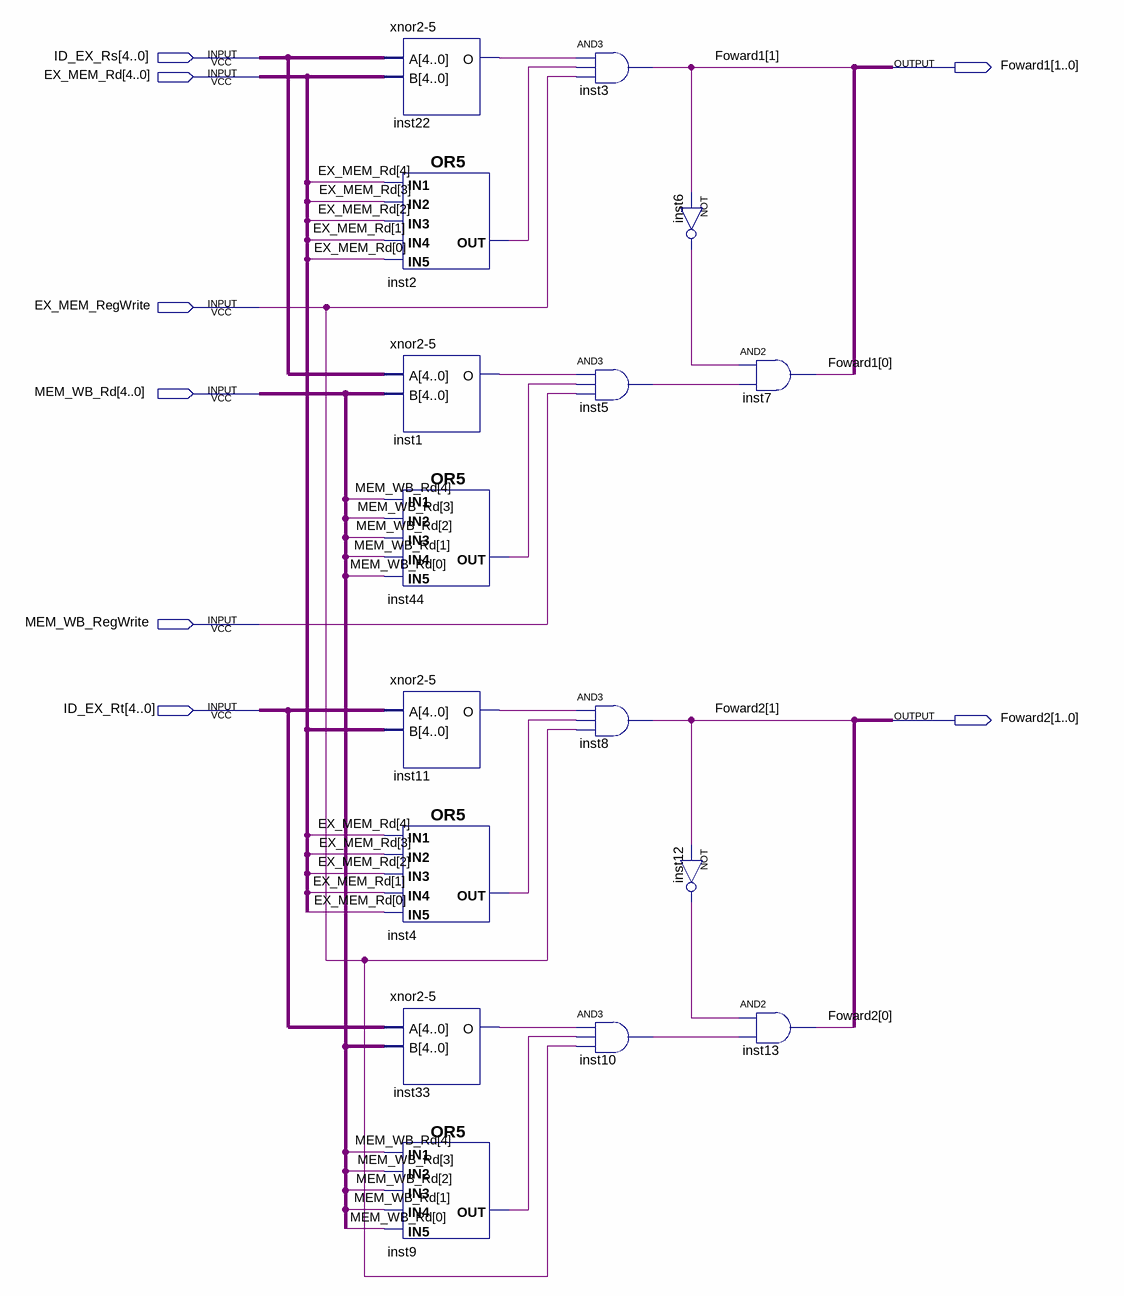
[diagram p0: schematic sheet]
// Quartus schematic FowardingUnit.bdf as structural Verilog: 16 symbols, 8 pins
module FowardingUnit (
  input  [4:0] ID_EX_Rs,
  input  [4:0] EX_MEM_Rd,
  input  EX_MEM_RegWrite,
  input  [4:0] MEM_WB_Rd,
  input  MEM_WB_RegWrite,
  input  [4:0] ID_EX_Rt,
  output [1:0] Foward1,
  output [1:0] Foward2
);

  wire inst1_o, inst2_out, inst4_out, inst5_out, inst6_out, inst9_out, inst10_out, inst11_o, inst12_out,
       inst22_o, inst33_o, inst44_out;

  \xnor2-5  inst22 (.A(ID_EX_Rs), .B(EX_MEM_Rd), .O(inst22_o));
  or inst2 (inst2_out, EX_MEM_Rd[4], EX_MEM_Rd[3], EX_MEM_Rd[2], EX_MEM_Rd[1], EX_MEM_Rd[0]);
  \xnor2-5  inst1 (.A(ID_EX_Rs), .B(MEM_WB_Rd), .O(inst1_o));
  or inst44 (inst44_out, MEM_WB_Rd[4], MEM_WB_Rd[3], MEM_WB_Rd[2], MEM_WB_Rd[1], MEM_WB_Rd[0]);
  \xnor2-5  inst11 (.A(ID_EX_Rt), .B(EX_MEM_Rd), .O(inst11_o));
  or inst4 (inst4_out, EX_MEM_Rd[4], EX_MEM_Rd[3], EX_MEM_Rd[2], EX_MEM_Rd[1], EX_MEM_Rd[0]);
  \xnor2-5  inst33 (.A(ID_EX_Rt), .B(MEM_WB_Rd), .O(inst33_o));
  or inst9 (inst9_out, MEM_WB_Rd[4], MEM_WB_Rd[3], MEM_WB_Rd[2], MEM_WB_Rd[1], MEM_WB_Rd[0]);
  and inst3 (Foward1[1], inst22_o, inst2_out, EX_MEM_RegWrite);
  and inst5 (inst5_out, inst1_o, inst44_out, MEM_WB_RegWrite);
  and inst8 (Foward2[1], inst11_o, inst4_out, EX_MEM_RegWrite);
  and inst10 (inst10_out, inst33_o, inst9_out, EX_MEM_RegWrite);
  not inst6 (inst6_out, Foward1[1]);
  not inst12 (inst12_out, Foward2[1]);
  and inst7 (Foward1[0], inst6_out, inst5_out);
  and inst13 (Foward2[0], inst12_out, inst10_out);
endmodule
